# EAGLE schematic MOSFET_Board (EAGLE 9.2.1)

## Sheet 1 of 3
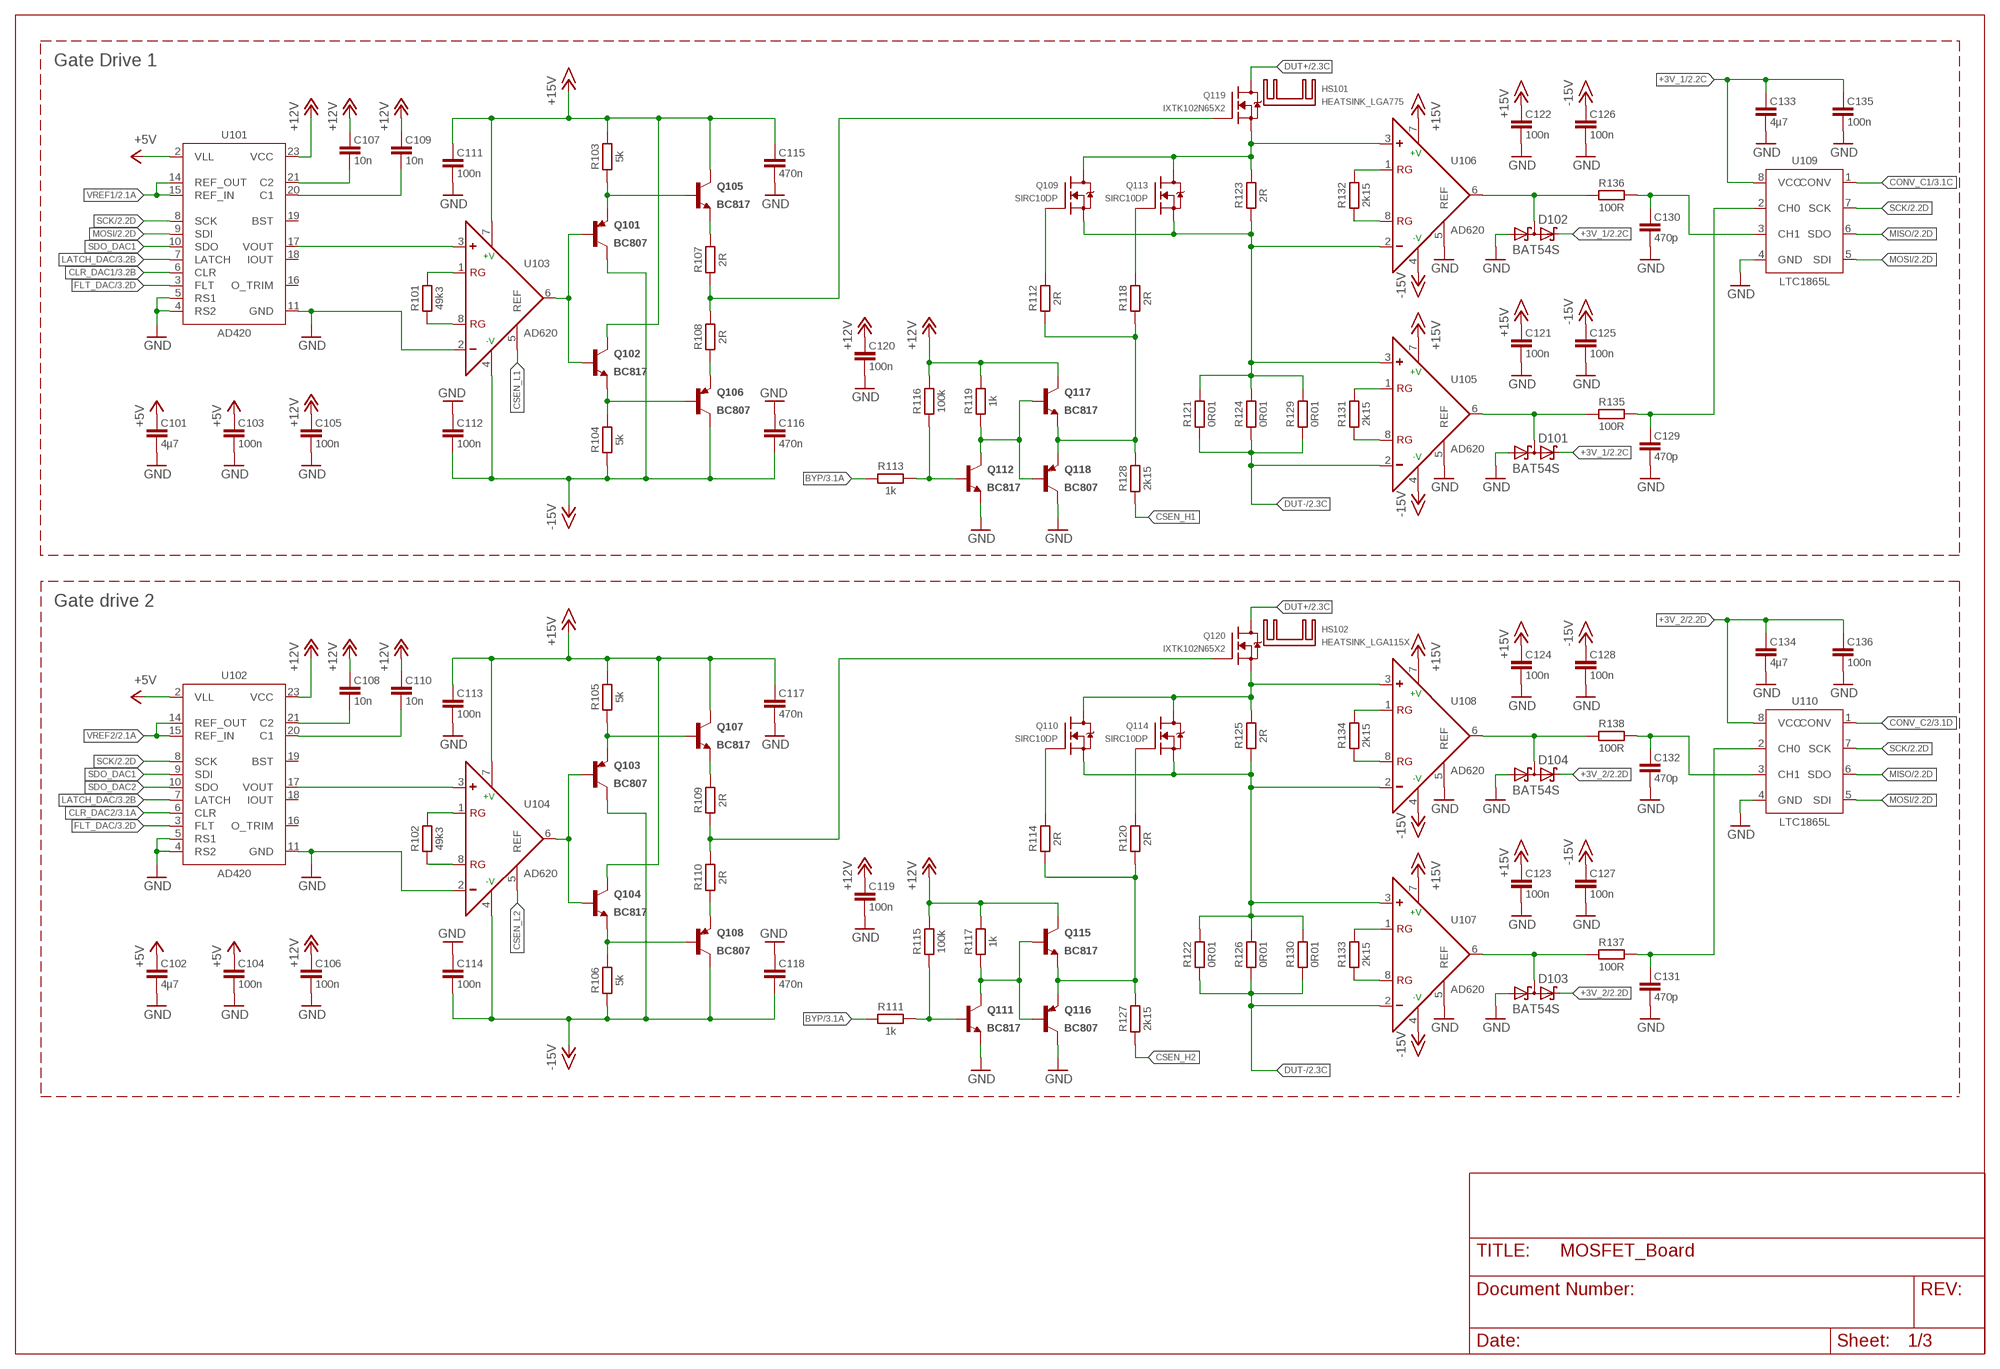
[diagram p0: schematic, sheet 1]

### Parts
C101  4µ7  C-EU-3216  [CAPC3216]
C102  4µ7  C-EU-3216  [CAPC3216]
C103  100n  C-EU-1608  [CAPC1608]
C104  100n  C-EU-1608  [CAPC1608]
C105  100n  C-EU-1608  [CAPC1608]
C106  100n  C-EU-1608  [CAPC1608]
C107  10n  C-EU-2012  [CAPC2012]
C108  10n  C-EU-2012  [CAPC2012]
C109  10n  C-EU-2012  [CAPC2012]
C110  10n  C-EU-2012  [CAPC2012]
C111  100n  C-EU-1608  [CAPC1608]
C112  100n  C-EU-1608  [CAPC1608]
C113  100n  C-EU-1608  [CAPC1608]
C114  100n  C-EU-1608  [CAPC1608]
C115  470n  C-EU-1608  [CAPC1608]
C116  470n  C-EU-1608  [CAPC1608]
C117  470n  C-EU-1608  [CAPC1608]
C118  470n  C-EU-1608  [CAPC1608]
C119  100n  C-EU-1608  [CAPC1608]
C120  100n  C-EU-1608  [CAPC1608]
C121  100n  C-EU-1608  [CAPC1608]
C122  100n  C-EU-1608  [CAPC1608]
C123  100n  C-EU-1608  [CAPC1608]
C124  100n  C-EU-1608  [CAPC1608]
C125  100n  C-EU-1608  [CAPC1608]
C126  100n  C-EU-1608  [CAPC1608]
C127  100n  C-EU-1608  [CAPC1608]
C128  100n  C-EU-1608  [CAPC1608]
C129  470p  C-EU-1608  [CAPC1608]
C130  470p  C-EU-1608  [CAPC1608]
C131  470p  C-EU-1608  [CAPC1608]
C132  470p  C-EU-1608  [CAPC1608]
C133  4µ7  C-EU-3216  [CAPC3216]
C134  4µ7  C-EU-3216  [CAPC3216]
C135  100n  C-EU-1608  [CAPC1608]
C136  100n  C-EU-1608  [CAPC1608]
D101  BAT54S  [SOT23]
D102  BAT54S  [SOT23]
D103  BAT54S  [SOT23]
D104  BAT54S  [SOT23]
HS101  HEATSINK_LGA775  [D95263-001]
HS102  HEATSINK_LGA115X  [E97378-001]
Q101  BC807  [SOT23]
Q102  BC817  [SOT23]
Q103  BC807  [SOT23]
Q104  BC817  [SOT23]
Q105  BC817  [SOT23]
Q106  BC807  [SOT23]
Q107  BC817  [SOT23]
Q108  BC807  [SOT23]
Q109  SIRC10DP  [POWERPAK-SO-8]
Q110  SIRC10DP  [POWERPAK-SO-8]
Q111  BC817  [SOT23]
Q112  BC817  [SOT23]
Q113  SIRC10DP  [POWERPAK-SO-8]
Q114  SIRC10DP  [POWERPAK-SO-8]
Q115  BC817  [SOT23]
Q116  BC807  [SOT23]
Q117  BC817  [SOT23]
Q118  BC807  [SOT23]
Q119  IXTK102N65X2  IXTK102N65X2R  [TO-264P-H-PADUP]
Q120  IXTK102N65X2  IXTK102N65X2R  [TO-264P-H-PADUP]
R101  49k3  R-EU-1608  [RESC1608]
R102  49k3  R-EU-1608  [RESC1608]
R103  5k  R-EU-1608  [RESC1608]
R104  5k  R-EU-1608  [RESC1608]
R105  5k  R-EU-1608  [RESC1608]
R106  5k  R-EU-1608  [RESC1608]
R107  2R  R-EU-3216  [RESC3216]
R108  2R  R-EU-3216  [RESC3216]
R109  2R  R-EU-3216  [RESC3216]
R110  2R  R-EU-3216  [RESC3216]
R111  1k  R-EU-1608  [RESC1608]
R112  2R  R-EU-3216  [RESC3216]
R113  1k  R-EU-1608  [RESC1608]
R114  2R  R-EU-3216  [RESC3216]
R115  100k  R-EU-1608  [RESC1608]
R116  100k  R-EU-1608  [RESC1608]
R117  1k  R-EU-1608  [RESC1608]
R118  2R  R-EU-3216  [RESC3216]
R119  1k  R-EU-1608  [RESC1608]
R120  2R  R-EU-3216  [RESC3216]
R121  0R01  R-EU-6332  [RESC6332]
R122  0R01  R-EU-6332  [RESC6332]
R123  2R  R-EU-3216  [RESC3216]
R124  0R01  R-EU-6332  [RESC6332]
R125  2R  R-EU-3216  [RESC3216]
R126  0R01  R-EU-6332  [RESC6332]
R127  2k15  R-EU-2012  [RESC2012]
R128  2k15  R-EU-2012  [RESC2012]
R129  0R01  R-EU-6332  [RESC6332]
R130  0R01  R-EU-6332  [RESC6332]
R131  2k15  R-EU-2012  [RESC2012]
R132  2k15  R-EU-2012  [RESC2012]
R133  2k15  R-EU-2012  [RESC2012]
R134  2k15  R-EU-2012  [RESC2012]
R135  100R  R-EU-1608  [RESC1608]
R136  100R  R-EU-1608  [RESC1608]
R137  100R  R-EU-1608  [RESC1608]
R138  100R  R-EU-1608  [RESC1608]
U101  AD420  AD420RW-24  [SO24W]
U102  AD420  AD420RW-24  [SO24W]
U103  AD620  AD620R-8  [SO8]
U104  AD620  AD620R-8  [SO8]
U105  AD620  AD620R-8  [SO8]
U106  AD620  AD620R-8  [SO8]
U107  AD620  AD620R-8  [SO8]
U108  AD620  AD620R-8  [SO8]
U109  LTC1865L  [SO8]
U110  LTC1865L  [SO8]

### Nets
+3V_1: C133.1 C135.1 D101.2(C2) D102.2(C2) U109.8(VCC) ; also sheet 2
+3V_2: C134.1 C136.1 D103.2(C2) D104.2(C2) U110.8(VCC) ; also sheet 2
+5V: C101.1 C102.1 C103.1 C104.1 U101.2(VLL) U102.2(VLL) ; also sheet 2,3
+12V: C105.1 C106.1 C107.1 C108.1 C109.1 C110.1 C119.1 C120.1 Q115.3(C) Q117.3(C) R115.2 R116.2 R117.2 R119.2 U101.23(VCC) U102.23(VCC) ; also sheet 2
+15V: C111.1 C113.1 C115.1 C117.1 C121.1 C122.1 C123.1 C124.1 Q102.3(C) Q104.3(C) Q105.3(C) Q107.3(C) R103.2 R105.2 U103.7(+V) U104.7(+V) U105.7(+V) U106.7(+V) U107.7(+V) U108.7(+V) ; also sheet 2
-15V: C112.2 C114.2 C116.2 C118.2 C125.1 C126.1 C127.1 C128.1 Q101.3(C) Q103.3(C) Q106.3(C) Q108.3(C) R104.1 R106.1 U103.4(-V) U104.4(-V) U105.4(-V) U106.4(-V) U107.4(-V) U108.4(-V) ; also sheet 2
BPY1G1: Q109.4(G) R112.2
BYP: R111.1 R113.1 ; also sheet 3
BYP1: Q117.2(E) Q118.2(E) R112.1 R118.1 R128.1
BYP1G2: Q113.4(G) R118.2
BYP2: Q115.2(E) Q116.2(E) R114.1 R120.1 R127.2
BYP2G1: Q110.4(G) R114.2
BYP2G2: Q114.4(G) R120.2
CLR_DAC1: U101.6(CLR) ; also sheet 3
CLR_DAC2: U102.6(CLR) ; also sheet 3
CONV_C1: U109.1(CONV) ; also sheet 3
CONV_C2: U110.1(CONV) ; also sheet 3
CSEN_H1: Q109.1(S) Q109.2(S) Q109.3(S) Q113.1(S) Q113.2(S) Q113.3(S) R121.2 R123.1 R124.2 R128.2 R129.2 U105.3(+) U106.2(-)
CSEN_H2: Q110.1(S) Q110.2(S) Q110.3(S) Q114.1(S) Q114.2(S) Q114.3(S) R122.2 R125.1 R126.2 R127.1 R130.2 U107.3(+) U108.2(-)
CSEN_L1: Q109.5(D) Q109.6(D) Q109.7(D) Q109.8(D) Q113.5(D) Q113.6(D) Q113.7(D) Q113.8(D) Q119.1(S) R123.2 U103.5(REF) U106.3(+)
CSEN_L2: Q110.5(D) Q110.6(D) Q110.7(D) Q110.8(D) Q114.5(D) Q114.6(D) Q114.7(D) Q114.8(D) Q120.1(S) R125.2 U104.5(REF) U108.3(+)
DUT+ [DUT+]: Q119.2(D) Q120.2(D) ; also sheet 2
DUT- [DUT-]: R121.1 R122.1 R124.1 R126.1 R129.1 R130.1 U105.2(-) U107.2(-) ; also sheet 2
FLT_DAC: U101.3(FLT) U102.3(FLT) ; also sheet 3
GND: C101.2 C102.2 C103.2 C104.2 C105.2 C106.2 C111.2 C112.1 C113.2 C114.1 C115.2 C116.1 C117.2 C118.1 C119.2 C120.2 C121.2 C122.2 C123.2 C124.2 C125.2 C126.2 C127.2 C128.2 C129.2 C130.2 C131.2 C132.2 C133.2 C134.2 C135.2 C136.2 D101.1(A1) D102.1(A1) D103.1(A1) D104.1(A1) Q111.2(E) Q112.2(E) Q116.3(C) Q118.3(C) U101.4(RS2) U101.5(RS1) U101.11(GND) U102.4(RS2) U102.5(RS1) U102.11(GND) U103.2(-) U104.2(-) U105.5(REF) U106.5(REF) U107.5(REF) U108.5(REF) U109.4(GND) U110.4(GND) ; also sheet 2,3
HIGHC1: C129.1 R135.2 U109.2(CH0)
HIGHC2: C131.1 R137.2 U110.2(CH0)
LATCH_DAC: U101.7(LATCH) U102.7(LATCH) ; also sheet 3
LGATE_1: Q119.3(G) R107.1 R108.2
LGATE_2: Q120.3(G) R109.1 R110.2
LOWC1: C130.1 R136.2 U109.3(CH1)
LOWC2: C132.1 R138.2 U110.3(CH1)
MISO: U109.6(SDO) U110.6(SDO) ; also sheet 2,3
MOSI: U101.9(SDI) U109.5(SDI) U110.5(SDI) ; also sheet 2,3
N$1: Q101.2(E) Q105.1(B) R103.1
N$2: R101.2 U103.1(RG)
N$3: C107.2 U101.21(C2)
N$4: C109.2 U101.20(C1)
N$5: Q112.3(C) Q117.1(B) Q118.1(B) R119.1
N$6: R101.1 U103.8(RG)
N$7: D101.3(C1A2) R135.1 U105.6(OUT)
N$8: Q112.1(B) R113.2 R116.1
N$9: U101.17(VOUT) U103.3(+)
N$11: Q106.2(E) R108.1
N$12: Q103.2(E) Q107.1(B) R105.1
N$13: Q105.2(E) R107.2
N$14: Q108.2(E) R110.1
N$15: Q107.2(E) R109.2
N$16: D102.3(C1A2) R136.1 U106.6(OUT)
N$25: Q111.3(C) Q115.1(B) Q116.1(B) R117.1
N$31: Q111.1(B) R111.2 R115.1
N$41: C108.2 U102.21(C2)
N$42: C110.2 U102.20(C1)
N$43: Q103.1(B) Q104.1(B) U104.6(OUT)
N$44: Q104.2(E) Q108.1(B) R106.2
N$49: R102.2 U104.1(RG)
N$50: R102.1 U104.8(RG)
N$51: U102.17(VOUT) U104.3(+)
N$56: D103.3(C1A2) R137.1 U107.6(OUT)
N$57: D104.3(C1A2) R138.1 U108.6(OUT)
N$67: Q101.1(B) Q102.1(B) U103.6(OUT)
N$68: Q102.2(E) Q106.1(B) R104.2
RG1_L1: R133.2 U107.1(RG)
RG1_L2: R134.2 U108.1(RG)
RG1_L3: R131.2 U105.1(RG)
RG1_L4: R132.2 U106.1(RG)
RG2_L1: R133.1 U107.8(RG)
RG2_L2: R134.1 U108.8(RG)
RG2_L3: R131.1 U105.8(RG)
RG2_L4: R132.1 U106.8(RG)
SCK: U101.8(SCK) U102.8(SCK) U109.7(SCK) U110.7(SCK) ; also sheet 2,3
SDO_DAC1: U101.10(SDO) U102.9(SDI)
SDO_DAC2: U102.10(SDO)
VREF1: U101.14(REF_OUT) U101.15(REF_IN) ; also sheet 2
VREF2: U102.14(REF_OUT) U102.15(REF_IN) ; also sheet 2
Unconnected: U101.16(O_TRIM) U101.18(IOUT) U101.19(BST) U102.16(O_TRIM) U102.18(IOUT) U102.19(BST)

### Notes on the sheet
- Gate Drive 1
- Gate drive 2

## Sheet 2 of 3
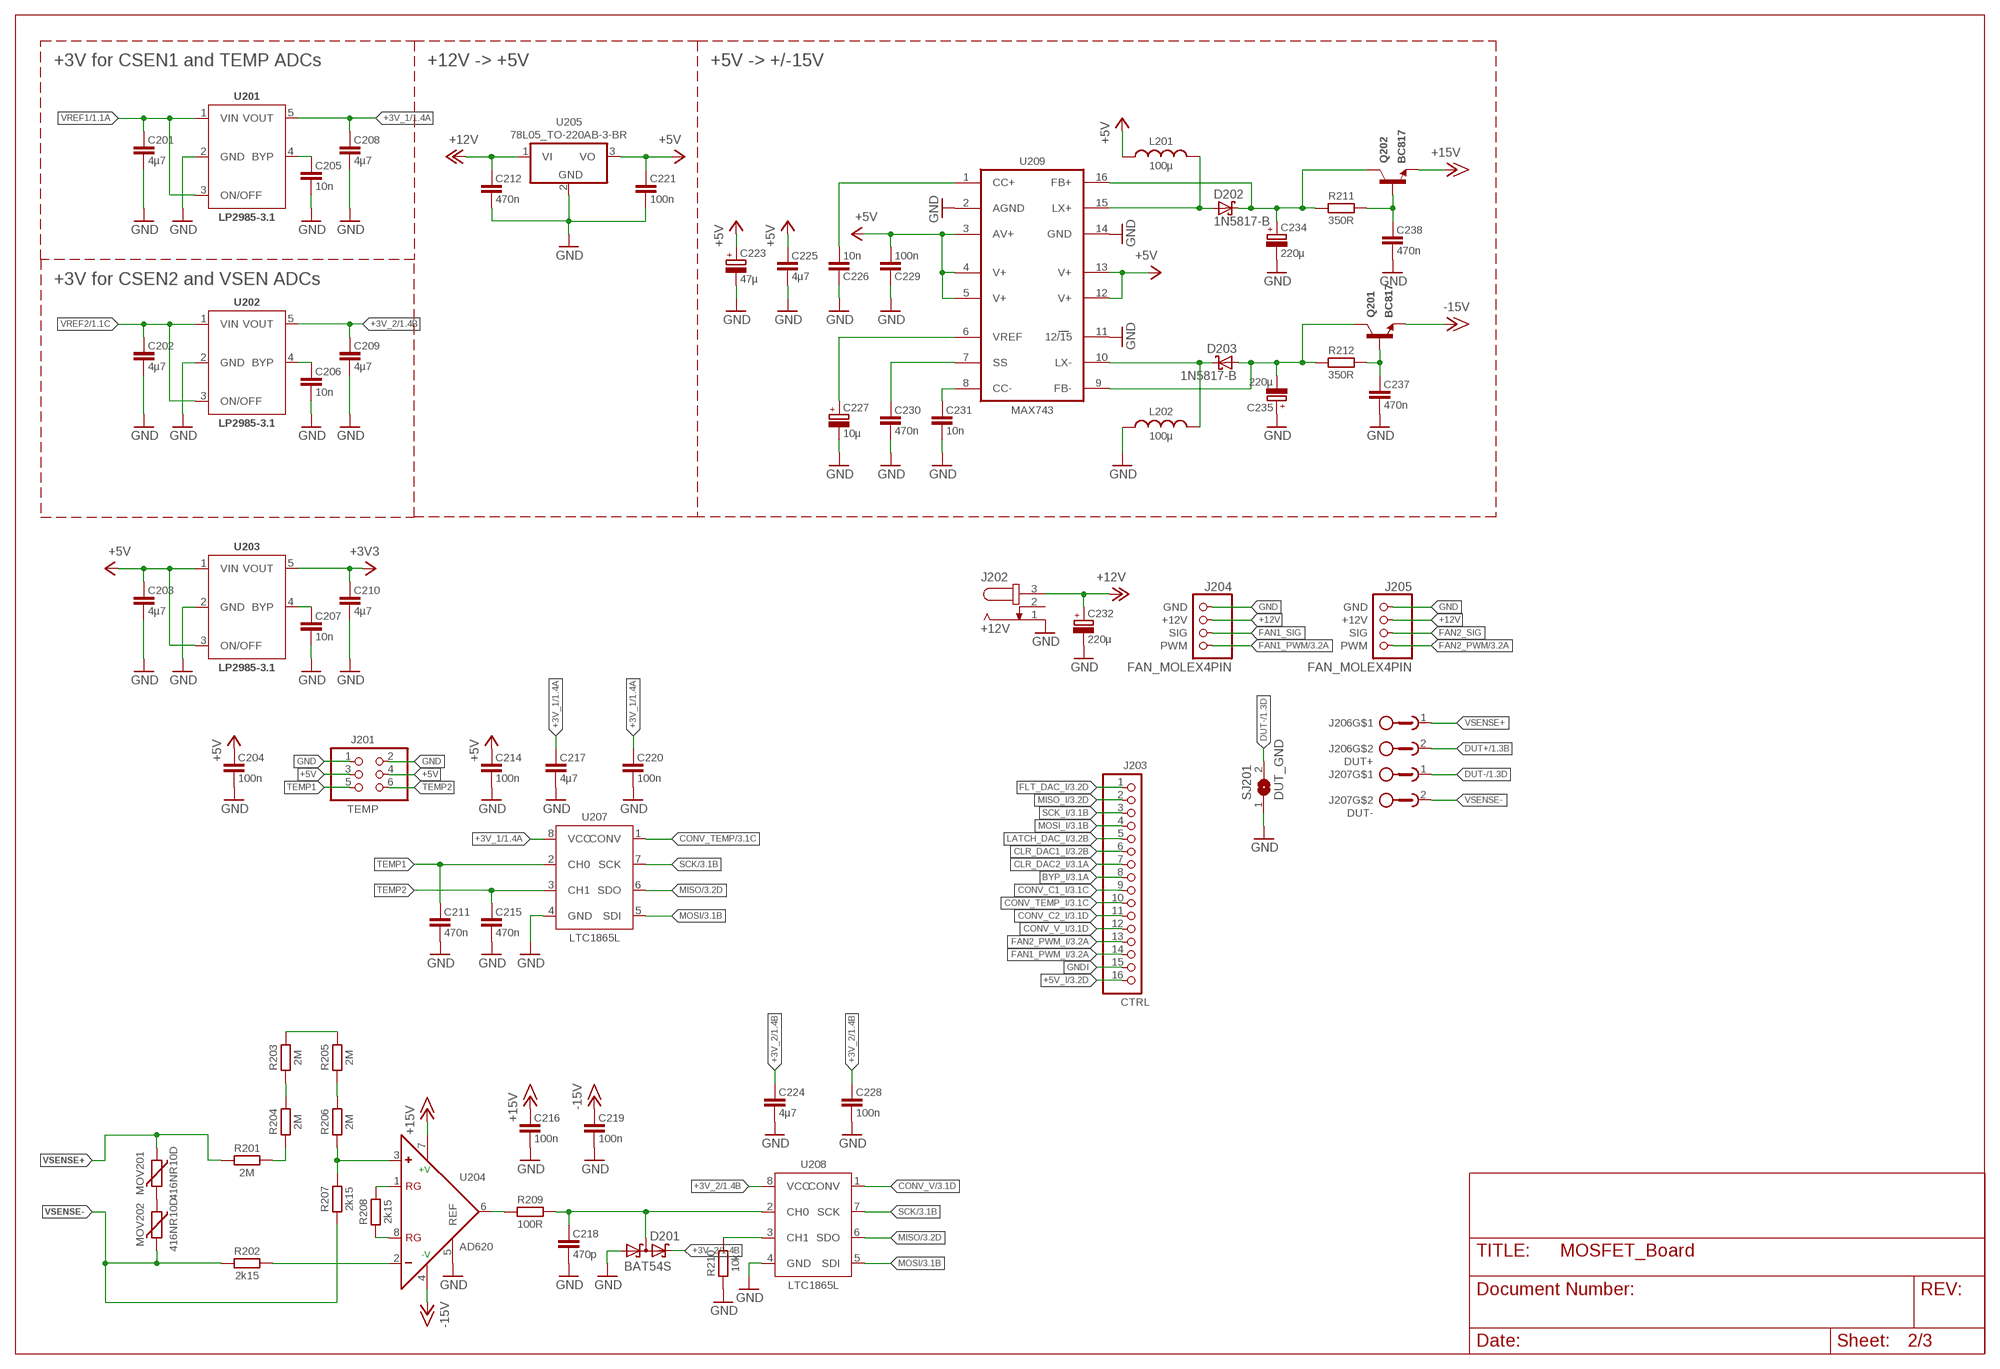
[diagram p1: schematic, sheet 2]

### Parts
C201  4µ7  C-EU-3216  [CAPC3216]
C202  4µ7  C-EU-3216  [CAPC3216]
C203  4µ7  C-EU-3216  [CAPC3216]
C204  100n  C-EU-1608  [CAPC1608]
C205  10n  C-EU-2012  [CAPC2012]
C206  10n  C-EU-2012  [CAPC2012]
C207  10n  C-EU-2012  [CAPC2012]
C208  4µ7  C-EU-3216  [CAPC3216]
C209  4µ7  C-EU-3216  [CAPC3216]
C210  4µ7  C-EU-3216  [CAPC3216]
C211  470n  C-EU-1608  [CAPC1608]
C212  470n  C-EU-1608  [CAPC1608]
C214  100n  C-EU-1608  [CAPC1608]
C215  470n  C-EU-1608  [CAPC1608]
C216  100n  C-EU-1608  [CAPC1608]
C217  4µ7  C-EU-3216  [CAPC3216]
C218  470p  C-EU-1608  [CAPC1608]
C219  100n  C-EU-1608  [CAPC1608]
C220  100n  C-EU-1608  [CAPC1608]
C221  100n  C-EU-1608  [CAPC1608]
C223  47µ  CPOL-7343-DE  [CAPCP7343]
C224  4µ7  C-EU-3216  [CAPC3216]
C225  4µ7  C-EU-3216  [CAPC3216]
C226  10n  C-EU-2012  [CAPC2012]
C227  10µ  CPOL-6032-C  [CAPCP6032]
C228  100n  C-EU-1608  [CAPC1608]
C229  100n  C-EU-1608  [CAPC1608]
C230  470n  C-EU-1608  [CAPC1608]
C231  10n  C-EU-2012  [CAPC2012]
C232  220µ  CPOL_CAPPRD500W60D1000  [CAPPRD500W60D1000H]
C234  220µ  CPOL_CAPPRD500W60D1000  [CAPPRD500W60D1000H]
C235  220µ  CPOL_CAPPRD500W60D1000  [CAPPRD500W60D1000H]
C237  470n  C-EU-1608  [CAPC1608]
C238  470n  C-EU-1608  [CAPC1608]
D201  BAT54S  [SOT23]
D202  1N5817-B  [DO41-7.6]
D203  1N5817-B  [DO41-7.6]
J201  TEMP  HEAD_2X3_MALE  [HEAD_MALE_2X3]
J202  +12V  JACK-PLUG1  [SPC4078]
J203  CTRL  HEAD_1X16_MALE  [HEAD_MALE_1X16]
J204  FAN_MOLEX4PIN  [MOLEX_47053-1000]
J205  FAN_MOLEX4PIN  [MOLEX_47053-1000]
J206  DUT+  AMPHENOL_TERM-BLOCK_2  [AMPHENOL-12-762_2]
J207  DUT-  AMPHENOL_TERM-BLOCK_2  [AMPHENOL-12-762_2]
L201  100µ  L-EU_MSS1260  [MSS1260]
L202  100µ  L-EU_MSS1260  [MSS1260]
MOV201  416NR10D  MOV_9.5-DISK  [DISK_9.5MM]
MOV202  416NR10D  MOV_9.5-DISK  [DISK_9.5MM]
Q201  BC817  [SOT23]
Q202  BC817  [SOT23]
R201  2M  R-EU-3216  [RESC3216]
R202  2k15  R-EU-2012  [RESC2012]
R203  2M  R-EU-3216  [RESC3216]
R204  2M  R-EU-3216  [RESC3216]
R205  2M  R-EU-3216  [RESC3216]
R206  2M  R-EU-3216  [RESC3216]
R207  2k15  R-EU-2012  [RESC2012]
R208  2k15  R-EU-2012  [RESC2012]
R209  100R  R-EU-1608  [RESC1608]
R210  10k  R-EU-1608  [RESC1608]
R211  350R  R-EU-1608  [RESC1608]
R212  350R  R-EU-1608  [RESC1608]
SJ201  DUT_GND  SJW  [SJW]
U201  LP2985-3.1  [SOT23-5L]
U202  LP2985-3.1  [SOT23-5L]
U203  LP2985-3.1  [SOT23-5L]
U204  AD620  AD620R-8  [SO8]
U205  78L05_TO-220AB-3-BR  [TO-220AB-3-BR]
U207  LTC1865L  [SO8]
U208  LTC1865L  [SO8]
U209  MAX743  MAX743WE  [SO16W]

### Nets
+3V3: C210.1 U203.5(VOUT) ; also sheet 3
+3V_1: C208.1 C217.1 C220.1 U201.5(VOUT) U207.8(VCC) ; also sheet 1
+3V_2: C209.1 C224.1 C228.1 D201.2(C2) U202.5(VOUT) U208.8(VCC) ; also sheet 1
+5V: C203.1 C204.1 C214.1 C221.1 C223.+ C225.1 C229.2 J201.3 J201.4 L201.1 U203.1(VIN) U203.3(ON/OFF) U205.3(VO) U209.3(AV+) U209.4(V+) U209.5(V+) U209.12(V+) U209.13(V+) ; also sheet 1,3
+5V_I [default_iso]: J203.16 ; also sheet 3
+12V: C212.1 C232.+ J202.3 J204.2(+12V) J205.2(+12V) U205.1(VI) ; also sheet 1
+15V: C216.1 Q202.2(E) U204.7(+V) ; also sheet 1
-15V: C219.1 Q201.2(E) U204.4(-V) ; also sheet 1
BYP_I [default_iso]: J203.8 ; also sheet 3
CLR_DAC1_I [default_iso]: J203.6 ; also sheet 3
CLR_DAC2_I [default_iso]: J203.7 ; also sheet 3
CONV_C1_I [default_iso]: J203.9 ; also sheet 3
CONV_C2_I [default_iso]: J203.11 ; also sheet 3
CONV_TEMP: U207.1(CONV) ; also sheet 3
CONV_TEMP_I [default_iso]: J203.10 ; also sheet 3
CONV_V: U208.1(CONV) ; also sheet 3
CONV_V_I [default_iso]: J203.12 ; also sheet 3
DUT+ [DUT+]: J206.2 ; also sheet 1
DUT- [DUT-]: J207.1 SJ201.2 ; also sheet 1
FAN1_PWM: J204.4(PWM) ; also sheet 3
FAN1_PWM_I [default_iso]: J203.14 ; also sheet 3
FAN1_SIG: J204.3(SIG)
FAN2_PWM: J205.4(PWM) ; also sheet 3
FAN2_PWM_I [default_iso]: J203.13 ; also sheet 3
FAN2_SIG: J205.3(SIG)
FLT_DAC_I [default_iso]: J203.1 ; also sheet 3
GND: C201.2 C202.2 C203.2 C204.2 C205.2 C206.2 C207.2 C208.2 C209.2 C210.2 C211.2 C212.2 C214.2 C215.2 C216.2 C217.2 C218.2 C219.2 C220.2 C221.2 C223.- C224.2 C225.2 C226.1 C227.- C228.2 C229.1 C230.2 C231.2 C232.- C234.- C235.+ C237.2 C238.2 D201.1(A1) J201.1 J201.2 J202.1 J204.1(GND) J205.1(GND) L202.2 R210.1 SJ201.1 U201.2(GND) U202.2(GND) U203.2(GND) U204.5(REF) U205.2(GND) U207.4(GND) U208.4(GND) U209.2(AGND) U209.11(12/15) U209.14(GND) ; also sheet 1,3
GNDI [default_iso]: J203.15 ; also sheet 3
LATCH_DAC_I [default_iso]: J203.5 ; also sheet 3
MISO: U207.6(SDO) U208.6(SDO) ; also sheet 1,3
MISO_I [default_iso]: J203.2 ; also sheet 3
MOSI: U207.5(SDI) U208.5(SDI) ; also sheet 1,3
MOSI_I [default_iso]: J203.4 ; also sheet 3
N$10: C205.1 U201.4(BYP)
N$23: R209.1 U204.6(OUT)
N$24: R205.1 R206.2
N$26: R203.2 R205.2
N$27: R203.1 R204.2
N$28: MOV201.2 MOV202.1
N$29: R206.1 R207.2 U204.3(+)
N$30: C218.1 D201.3(C1A2) R209.2 U208.2(CH0)
N$32: C234.+ D202.C Q202.3(C) R211.1 U209.16(FB+)
N$33: R201.2 R204.1
N$34: C231.1 U209.8(CC-)
N$35: C230.1 U209.7(SS)
N$36: R202.2 U204.2(-)
N$37: C226.2 U209.1(CC+)
N$38: D202.A L201.2 U209.15(LX+)
N$39: D203.C L202.1 U209.10(LX-)
N$45: R210.2 U208.3(CH1)
N$62: C206.1 U202.4(BYP)
N$63: C238.1 Q202.1(B) R211.2
N$64: C235.- D203.A Q201.3(C) R212.1 U209.9(FB-)
N$65: C237.1 Q201.1(B) R212.2
N$66: C207.1 U203.4(BYP)
RG1_H6: R208.2 U204.1(RG)
RG2_H6: R208.1 U204.8(RG)
SCK: U207.7(SCK) U208.7(SCK) ; also sheet 1,3
SCK_I [default_iso]: J203.3 ; also sheet 3
TEMP1: C211.1 J201.5 U207.2(CH0)
TEMP2: C215.1 J201.6 U207.3(CH1)
VREF1: C201.1 U201.1(VIN) U201.3(ON/OFF) ; also sheet 1
VREF2: C202.1 U202.1(VIN) U202.3(ON/OFF) ; also sheet 1
VREF_MAX743: C227.+ U209.6(VREF)
VSENSE+ [VSENSE+]: J206.1 MOV201.1 R201.1
VSENSE- [VSENSE-]: J207.2 MOV202.2 R202.1 R207.1
Unconnected: J202.2

### Notes on the sheet
- +3V for CSEN1 and TEMP ADCs | +12V -> +5V | +5V -> +/-15V
- +3V for CSEN2 and VSEN ADCs

## Sheet 3 of 3
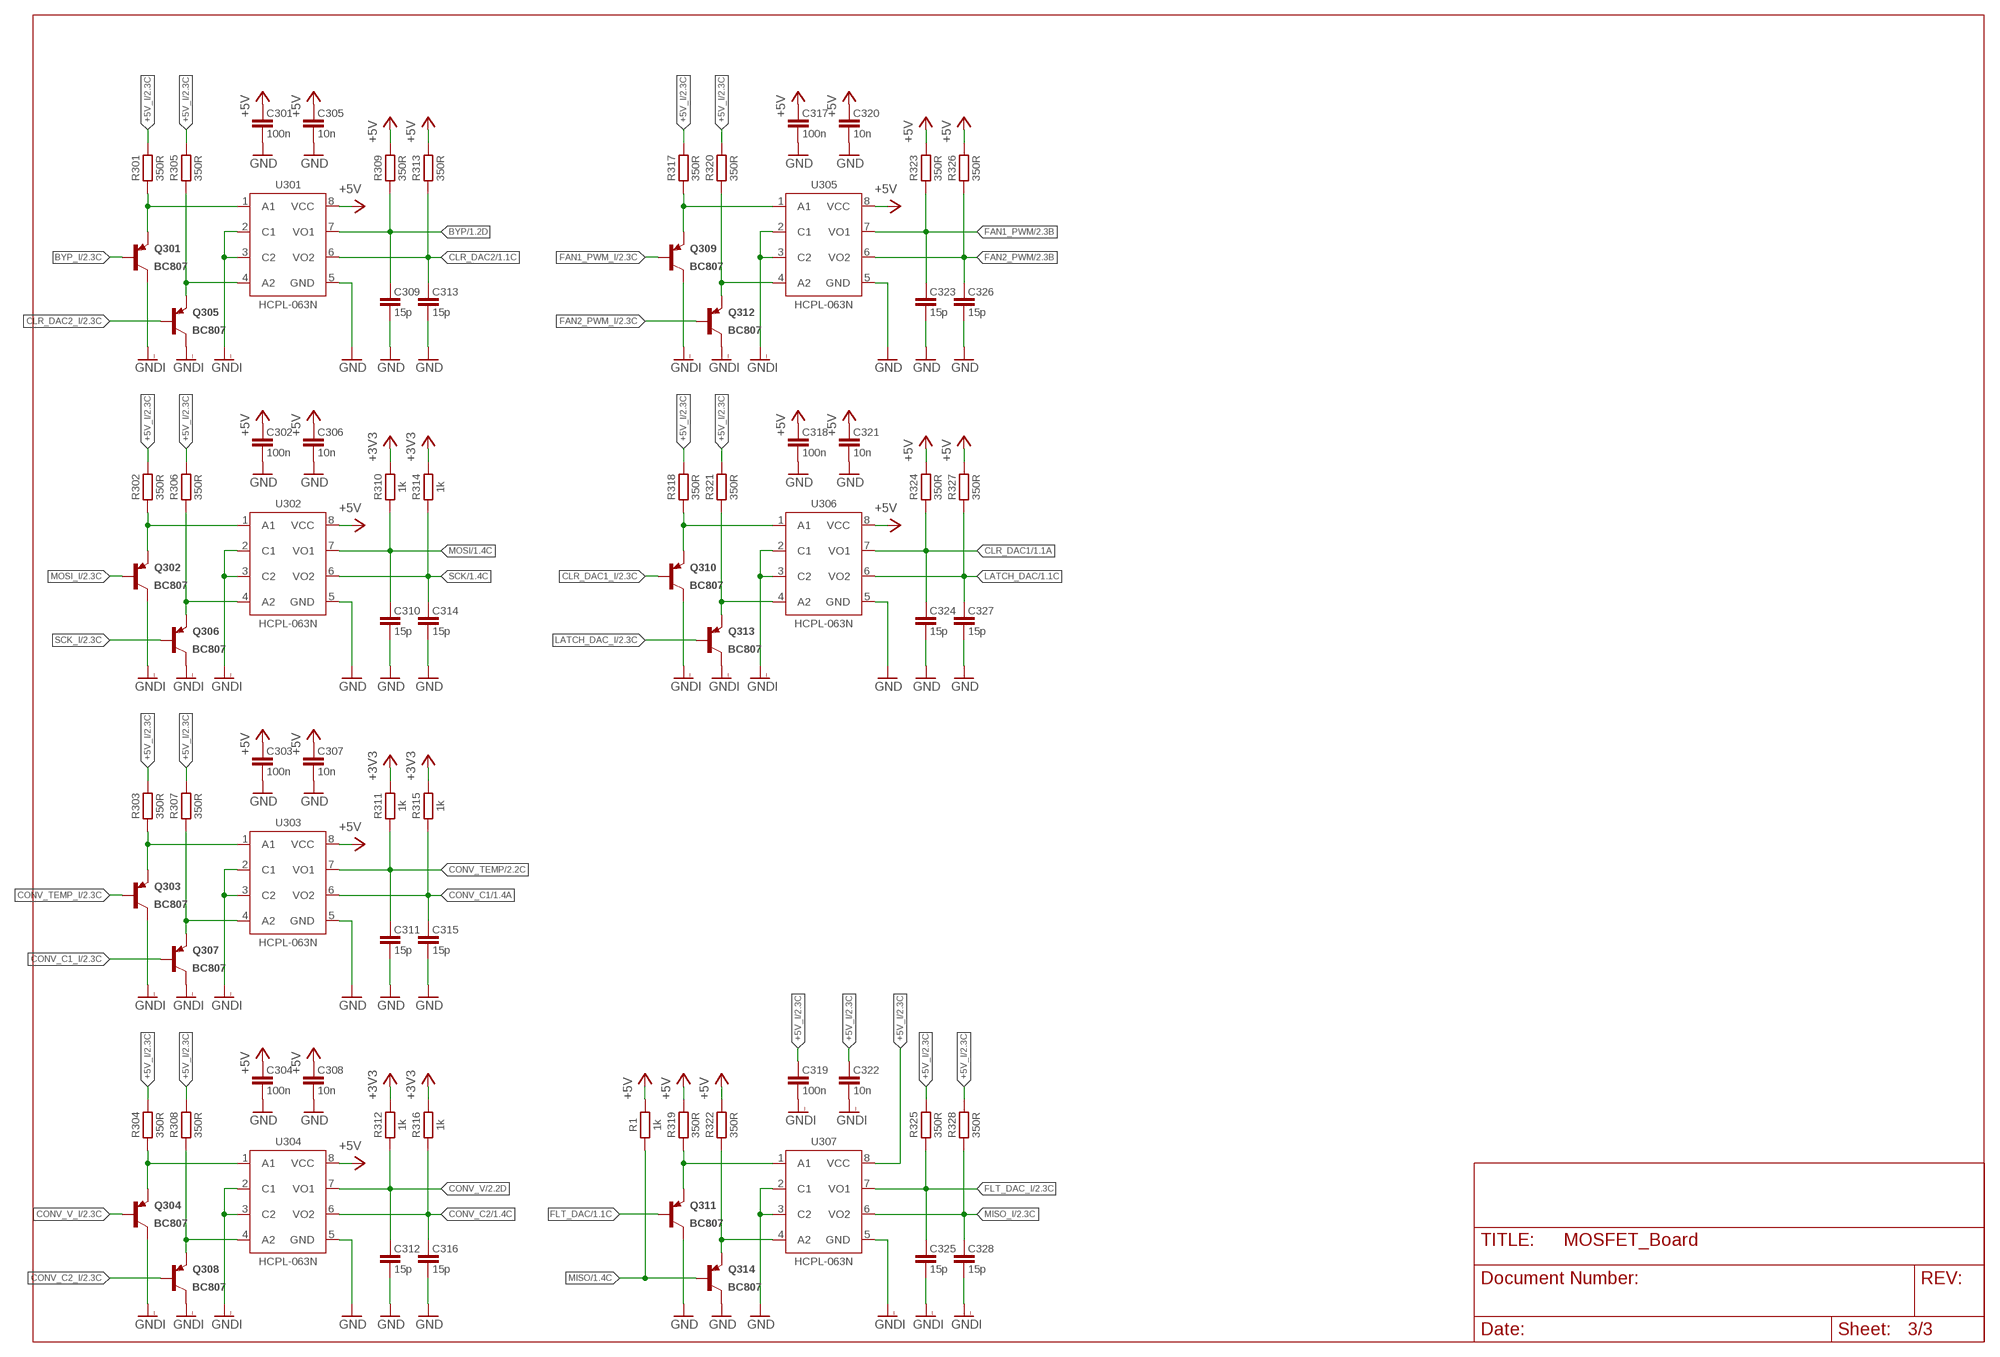
[diagram p2: schematic, sheet 3]

### Parts
C301  100n  C-EU-1608  [CAPC1608]
C302  100n  C-EU-1608  [CAPC1608]
C303  100n  C-EU-1608  [CAPC1608]
C304  100n  C-EU-1608  [CAPC1608]
C305  10n  C-EU-1608  [CAPC1608]
C306  10n  C-EU-1608  [CAPC1608]
C307  10n  C-EU-1608  [CAPC1608]
C308  10n  C-EU-1608  [CAPC1608]
C309  15p  C-EU-1608  [CAPC1608]
C310  15p  C-EU-1608  [CAPC1608]
C311  15p  C-EU-1608  [CAPC1608]
C312  15p  C-EU-1608  [CAPC1608]
C313  15p  C-EU-1608  [CAPC1608]
C314  15p  C-EU-1608  [CAPC1608]
C315  15p  C-EU-1608  [CAPC1608]
C316  15p  C-EU-1608  [CAPC1608]
C317  100n  C-EU-1608  [CAPC1608]
C318  100n  C-EU-1608  [CAPC1608]
C319  100n  C-EU-1608  [CAPC1608]
C320  10n  C-EU-1608  [CAPC1608]
C321  10n  C-EU-1608  [CAPC1608]
C322  10n  C-EU-1608  [CAPC1608]
C323  15p  C-EU-1608  [CAPC1608]
C324  15p  C-EU-1608  [CAPC1608]
C325  15p  C-EU-1608  [CAPC1608]
C326  15p  C-EU-1608  [CAPC1608]
C327  15p  C-EU-1608  [CAPC1608]
C328  15p  C-EU-1608  [CAPC1608]
Q301  BC807  [SOT23]
Q302  BC807  [SOT23]
Q303  BC807  [SOT23]
Q304  BC807  [SOT23]
Q305  BC807  [SOT23]
Q306  BC807  [SOT23]
Q307  BC807  [SOT23]
Q308  BC807  [SOT23]
Q309  BC807  [SOT23]
Q310  BC807  [SOT23]
Q311  BC807  [SOT23]
Q312  BC807  [SOT23]
Q313  BC807  [SOT23]
Q314  BC807  [SOT23]
R1  1k  R-EU-1608  [RESC1608]
R301  350R  R-EU-1608  [RESC1608]
R302  350R  R-EU-1608  [RESC1608]
R303  350R  R-EU-1608  [RESC1608]
R304  350R  R-EU-1608  [RESC1608]
R305  350R  R-EU-1608  [RESC1608]
R306  350R  R-EU-1608  [RESC1608]
R307  350R  R-EU-1608  [RESC1608]
R308  350R  R-EU-1608  [RESC1608]
R309  350R  R-EU-1608  [RESC1608]
R310  1k  R-EU-1608  [RESC1608]
R311  1k  R-EU-1608  [RESC1608]
R312  1k  R-EU-1608  [RESC1608]
R313  350R  R-EU-1608  [RESC1608]
R314  1k  R-EU-1608  [RESC1608]
R315  1k  R-EU-1608  [RESC1608]
R316  1k  R-EU-1608  [RESC1608]
R317  350R  R-EU-1608  [RESC1608]
R318  350R  R-EU-1608  [RESC1608]
R319  350R  R-EU-1608  [RESC1608]
R320  350R  R-EU-1608  [RESC1608]
R321  350R  R-EU-1608  [RESC1608]
R322  350R  R-EU-1608  [RESC1608]
R323  350R  R-EU-1608  [RESC1608]
R324  350R  R-EU-1608  [RESC1608]
R325  350R  R-EU-1608  [RESC1608]
R326  350R  R-EU-1608  [RESC1608]
R327  350R  R-EU-1608  [RESC1608]
R328  350R  R-EU-1608  [RESC1608]
U301  HCPL-063N  [SO8]
U302  HCPL-063N  [SO8]
U303  HCPL-063N  [SO8]
U304  HCPL-063N  [SO8]
U305  HCPL-063N  [SO8]
U306  HCPL-063N  [SO8]
U307  HCPL-063N  [SO8]

### Nets
+3V3: R310.2 R311.2 R312.2 R314.2 R315.2 R316.2 ; also sheet 2
+5V: C301.1 C302.1 C303.1 C304.1 C305.1 C306.1 C307.1 C308.1 C317.1 C318.1 C320.1 C321.1 R1.2 R309.2 R313.2 R319.2 R322.2 R323.2 R324.2 R326.2 R327.2 U301.8(VCC) U302.8(VCC) U303.8(VCC) U304.8(VCC) U305.8(VCC) U306.8(VCC) ; also sheet 1,2
+5V_I [default_iso]: C319.1 C322.1 R301.2 R302.2 R303.2 R304.2 R305.2 R306.2 R307.2 R308.2 R317.2 R318.2 R320.2 R321.2 R325.2 R328.2 U307.8(VCC) ; also sheet 2
BYP: C309.1 R309.1 U301.7(VO1) ; also sheet 1
BYP_I [default_iso]: Q301.1(B) ; also sheet 2
CLR_DAC1: C324.1 R324.1 U306.7(VO1) ; also sheet 1
CLR_DAC1_I [default_iso]: Q310.1(B) ; also sheet 2
CLR_DAC2: C313.1 R313.1 U301.6(VO2) ; also sheet 1
CLR_DAC2_I [default_iso]: Q305.1(B) ; also sheet 2
CONV_C1: C315.1 R315.1 U303.6(VO2) ; also sheet 1
CONV_C1_I [default_iso]: Q307.1(B) ; also sheet 2
CONV_C2: C316.1 R316.1 U304.6(VO2) ; also sheet 1
CONV_C2_I [default_iso]: Q308.1(B) ; also sheet 2
CONV_TEMP: C311.1 R311.1 U303.7(VO1) ; also sheet 2
CONV_TEMP_I [default_iso]: Q303.1(B) ; also sheet 2
CONV_V: C312.1 R312.1 U304.7(VO1) ; also sheet 2
CONV_V_I [default_iso]: Q304.1(B) ; also sheet 2
FAN1_PWM: C323.1 R323.1 U305.7(VO1) ; also sheet 2
FAN1_PWM_I [default_iso]: Q309.1(B) ; also sheet 2
FAN2_PWM: C326.1 R326.1 U305.6(VO2) ; also sheet 2
FAN2_PWM_I [default_iso]: Q312.1(B) ; also sheet 2
FLT_DAC: Q311.1(B) ; also sheet 1
FLT_DAC_I [default_iso]: C325.1 R325.1 U307.7(VO1) ; also sheet 2
GND: C301.2 C302.2 C303.2 C304.2 C305.2 C306.2 C307.2 C308.2 C309.2 C310.2 C311.2 C312.2 C313.2 C314.2 C315.2 C316.2 C317.2 C318.2 C320.2 C321.2 C323.2 C324.2 C326.2 C327.2 Q311.3(C) Q314.3(C) U301.5(GND) U302.5(GND) U303.5(GND) U304.5(GND) U305.5(GND) U306.5(GND) U307.2(C1) U307.3(C2) ; also sheet 1,2
GNDI [default_iso]: C319.2 C322.2 C325.2 C328.2 Q301.3(C) Q302.3(C) Q303.3(C) Q304.3(C) Q305.3(C) Q306.3(C) Q307.3(C) Q308.3(C) Q309.3(C) Q310.3(C) Q312.3(C) Q313.3(C) U301.2(C1) U301.3(C2) U302.2(C1) U302.3(C2) U303.2(C1) U303.3(C2) U304.2(C1) U304.3(C2) U305.2(C1) U305.3(C2) U306.2(C1) U306.3(C2) U307.5(GND) ; also sheet 2
LATCH_DAC: C327.1 R327.1 U306.6(VO2) ; also sheet 1
LATCH_DAC_I [default_iso]: Q313.1(B) ; also sheet 2
MISO: Q314.1(B) R1.1 ; also sheet 1,2
MISO_I [default_iso]: C328.1 R328.1 U307.6(VO2) ; also sheet 2
MOSI: C310.1 R310.1 U302.7(VO1) ; also sheet 1,2
MOSI_I [default_iso]: Q302.1(B) ; also sheet 2
N$17: Q311.2(E) R319.1 U307.1(A1)
N$18: Q314.2(E) R322.1 U307.4(A2)
N$19 [default_iso]: Q304.2(E) R304.1 U304.1(A1)
N$20 [default_iso]: Q308.2(E) R308.1 U304.4(A2)
N$21 [default_iso]: Q302.2(E) R302.1 U302.1(A1)
N$22 [default_iso]: Q306.2(E) R306.1 U302.4(A2)
N$40 [default_iso]: Q309.2(E) R317.1 U305.1(A1)
N$46 [default_iso]: Q312.2(E) R320.1 U305.4(A2)
N$47 [default_iso]: Q301.2(E) R301.1 U301.1(A1)
N$48 [default_iso]: Q305.2(E) R305.1 U301.4(A2)
N$58 [default_iso]: Q310.2(E) R318.1 U306.1(A1)
N$59 [default_iso]: Q313.2(E) R321.1 U306.4(A2)
N$76 [default_iso]: Q303.2(E) R303.1 U303.1(A1)
N$77 [default_iso]: Q307.2(E) R307.1 U303.4(A2)
SCK: C314.1 R314.1 U302.6(VO2) ; also sheet 1,2
SCK_I [default_iso]: Q306.1(B) ; also sheet 2

## Library data of the parts
C101-C136 C201-C212 C214-C221 C224-C226 C228-C231 C237 C238 C301-C328 = passives:C-EU
C223 C227 C232 C234 C235 = passives:CPOL
D101-D104 D201 = diode:BAT54S: Schottky Diodes Pin connection corrected 2011-05-04 Source: Fairchild .. BAT54.pdf
D202 D203 = diode:1N581*: 1.0A SCHOTTKY BARRIER RECTIFIER Source: http://www.diodes.com/datasheets/ds23001.pdf
HS101 HS102 = mechanical:HEATSINK
J201 = mechanical:HEAD_2X3
J202 = con-jack:JACK-PLUG: DC POWER JACK Power Jack, DC, Right Angle, Through Hole, Rated 5A at 16VDC, PC Terminals Distributor: Farnell (www.Farnell.de) Drawing: 84N1161.pdf / 84N1162.pdf Manufacturer: SPC Technology (www.spctechnology.com) Type: SPC4077 / SPC 4078; OC_FARNELL: unknown; OC_NEWARK: unknown
J203 = mechanical:HEAD_1X16
J204 J205 = mechanical:FAN_MOLEX
J206 J207 = mechanical:AMPHENOL_TERM-BLOCK_2
L201 L202 = passives:L-EU
MOV201 MOV202 = passives:MOV
Q101 Q103 Q106 Q108 Q116 Q118 Q301-Q314 = transistors:BC807
Q102 Q104 Q105 Q107 Q111 Q112 Q115 Q117 Q201 Q202 = transistors:BC817
Q109 Q110 Q113 Q114 = transistors:SIRC10DP
Q119 Q120 = transistors:IXTK102N65X2
R1 R101-R138 R201-R212 R301-R328 = passives:R-EU
SJ201 = jumper:SJ: SMD solder JUMPER
U101 U102 = ic:AD420: The AD420 is a complete digital to current loop output converter, designed to meet the needs of the industrial control market. It provides a high precision, fully integrated, low cost single-chip solution for generating current loop signals in a compact 24-lead SOIC or PDIP package. The output current range can be programmed to 4 mA to 20 mA, 0 mA to 20 mA or to an overrange function of 0 mA to 24 mA. The AD420 can alternatively provide a voltage output from a separate pin that can be configured to provide 0 V to 5 V, 0 V to 10 V, ±5 V, or ±10 V with the addition of a single external buffer amplifier.
U103-U108 U204 = ic:AD620
U109 U110 U207 U208 = ic:LTC1865L: The LTC®1864L/LTC1865L are 16-bit A/D converters that are offered in MSOP and SO-8 packages and operate on a single 3V supply. At 150ksps, the supply current is only 450µA. The supply current drops at lower speeds because the LTC1864L/LTC1865L automatically power down between conversions. These 16-bit switched capacitor successive approximation ADCs include sample-and-holds. The LTC1864L has a differential analog input with an external reference pin. The LTC1865L offers a softwareselectable 2-channel MUX and an external reference pin on the MSOP version. The 3-wire, serial I/O, small MSOP or SO-8 package and extremely high sample rate-to-power ratio make these ADCs ideal choices for compact, low power, high speed systems
U201-U203 = ic:LP2985
U205 = ic:78L05
U209 = ic:MAX743
U301-U307 = ic:HCPL-063N

## Net classes
0 default: drill 0.3 mm
1 DUT+: drill 0.3 mm, clearance 1.905 mm to class 0
2 DUT-: drill 0.3 mm, clearance 1.905 mm to class 1
3 VSENSE+: drill 0.3 mm, clearance 1.905 mm to class 0, clearance 1.905 mm to class 2
4 VSENSE-: drill 0.3 mm, clearance 1.905 mm to class 1, clearance 1.905 mm to class 3
5 default_iso: drill 0.3 mm, clearance 1.905 mm to class 0, clearance 1.905 mm to class 1, clearance 1.905 mm to class 2, clearance 1.905 mm to class 3, clearance 1.905 mm to class 4